# EAGLE design FlexiBoard (EAGLE 7.5.0)
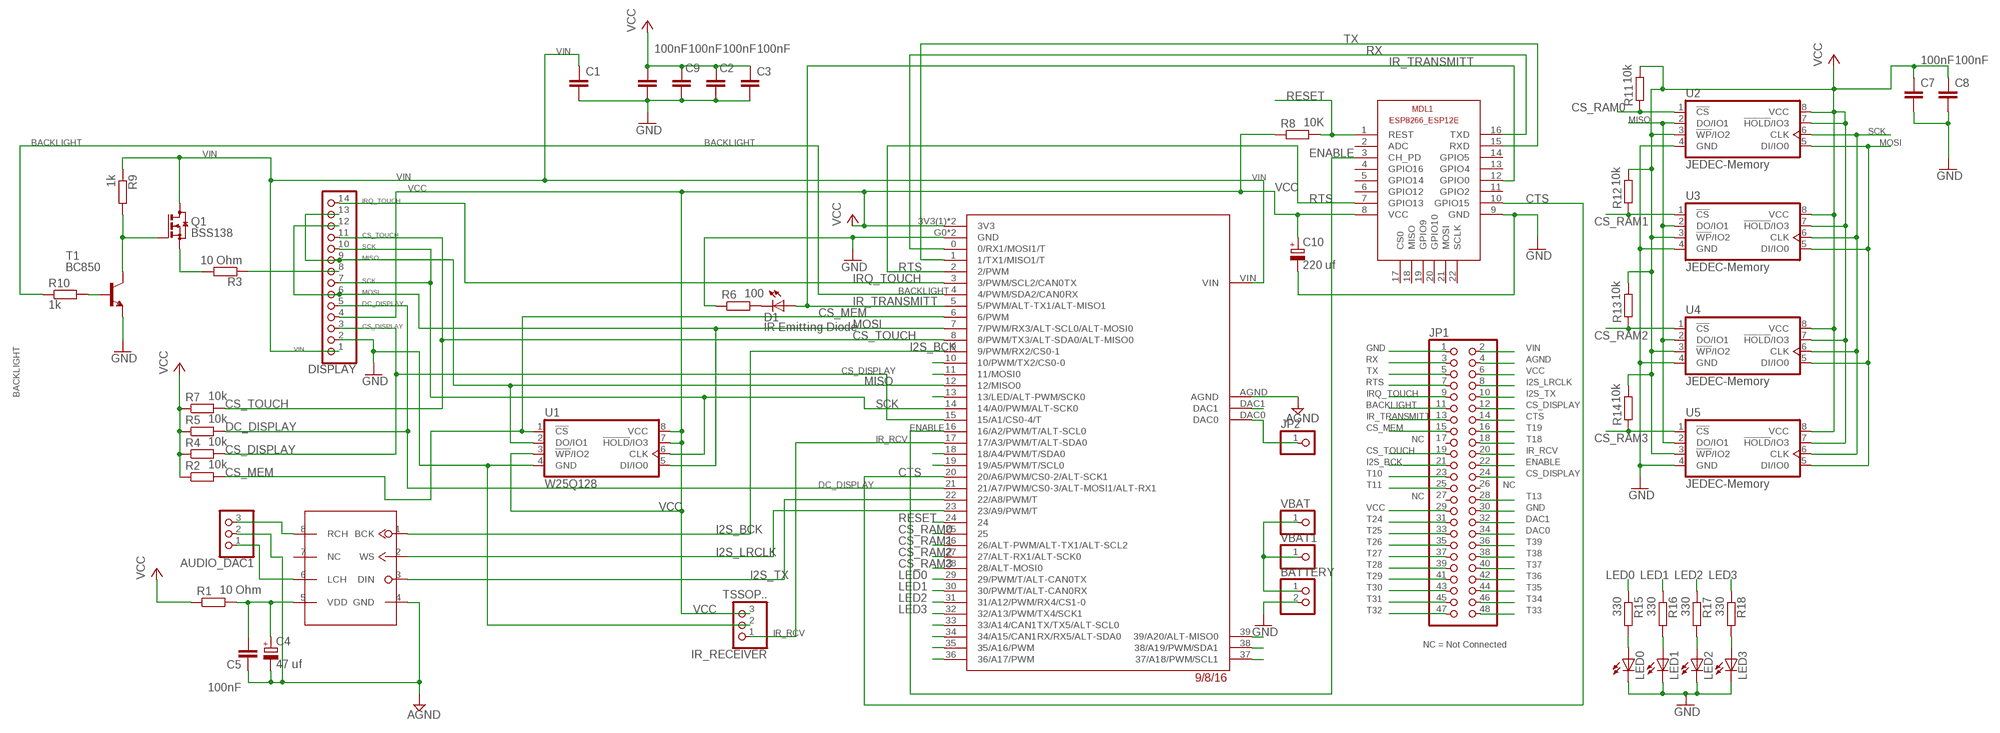
[diagram p0: schematic, sheet 1]

## Parts
AUDIO_DAC1  PINHD-1X3/90  [1X03/90]
BATTERY  PINHD-1X2  [1X02]
C1  100nF  C-EUC0603  [C0603]
C2  100nF  C-EUC0603  [C0603]
C3  100nF  C-EUC0603  [C0603]
C4  47 uf  CPOL-EUE1.8-4  [E1,8-4]
C5  100nF  C-EUC0603  [C0603]
C6  100nF  C-EUC0603  [C0603]
C7  100nF  C-EUC0603  [C0603]
C8  100nF  C-EUC0603  [C0603]
C9  100nF  C-EUC0603  [C0603]
C10  220 uf  CPOL-EUE1.8-4  [E1,8-4]
D1  IR Emitting Diode  SFH482  [SFH482]
DISPLAY  PINHD-1X14  [1X14]
IR_RECEIVER  TSSOP..  PINHD-1X3  [1X03]
JP1  PINHD-2X24  [2X24]
JP2  PINHD-1X1  [1X01]
LED0  LEDSML1206  [SML1206]
LED1  LEDSML1206  [SML1206]
LED2  LEDSML1206  [SML1206]
LED3  LEDSML1206  [SML1206]
MDL1  ESP8266-12EESP8266-ESP12E  [ESP8266-ESP12E]
PT8211  PT8211SO8  [SO8]
Q1  BSS138  BSS123  [SOT23]
R1  10 Ohm  R-EU_R0603  [R0603]
R2  10k  R-EU_R0603  [R0603]
R3  10 Ohm  R-EU_R0603  [R0603]
R4  10k  R-EU_R0603  [R0603]
R5  10k  R-EU_R0603  [R0603]
R6  100  R-EU_R0603  [R0603]
R7  10k  R-EU_R0603  [R0603]
R8  10K  R-EU_R0603  [R0603]
R9  1k  R-EU_R0603  [R0603]
R10  1k  R-EU_R0603  [R0603]
R11  10k  R-EU_R0603  [R0603]
R12  10k  R-EU_R0603  [R0603]
R13  10k  R-EU_R0603  [R0603]
R14  10k  R-EU_R0603  [R0603]
R15  330  R-EU_R0603  [R0603]
R16  330  R-EU_R0603  [R0603]
R17  330  R-EU_R0603  [R0603]
R18  330  R-EU_R0603  [R0603]
T1  BC850  [SOT23]
U1  W25Q128  W25Q40BVSS  [SO08-SS]
U2  JEDEC-Memory  W25Q40BVSS  [SO08-SS]
U3  JEDEC-Memory  W25Q40BVSS  [SO08-SS]
U4  JEDEC-Memory  W25Q40BVSS  [SO08-SS]
U5  JEDEC-Memory  W25Q40BVSS  [SO08-SS]
U$2  TEENSY36_OUTERPINS  [T36_OUTER_PINS]
VBAT  PINHD-1X1  [1X01]
VBAT1  PINHD-1X1  [1X01]

## Nets
AGND [AGND]: AUDIO_DAC1.2 C4.- C5.1 JP1.4 PT8211.4(GND) U$2.AGND
BACKLIGHT: JP1.11 R10.1 U$2.4(4/PWM/SDA2/CAN0RX)
CS_DISPLAY: DISPLAY.3 JP1.12 JP1.24 R4.2 U$2.15(15/A1/CS0-4/T)
CS_MEM [signal]: JP1.15 R2.2 U1.1(!CS!) U$2.6(6/PWM)
CS_RAM0: R11.1 U2.1(!CS!) U$2.25
CS_RAM1: R12.1 U3.1(!CS!) U$2.26(26/ALT-PWM/ALT-TX1/ALT-SCL2)
CS_RAM2: R13.1 U4.1(!CS!) U$2.27(27/ALT-RX1/ALT-SCK0)
CS_RAM3: R14.1 U5.1(!CS!) U$2.28(28/ALT-MOSI0)
CS_TOUCH: DISPLAY.11 JP1.19 R7.2 U$2.8(8/PWM/TX3/ALT-SDA0/ALT-MISO0)
CTS [signal]: JP1.14 MDL1.10(GPIO15) U$2.20(20/A6/PWM/CS0-2/ALT-SCK1)
DAC0 [DAC]: JP1.34 JP2.1 U$2.DAC0
DAC1 [DAC]: JP1.32 U$2.DAC1
DC_DISPLAY: DISPLAY.5 R5.2 U$2.21(21/A7/PWM/CS0-3/ALT-MOSI1/ALT-RX1)
ENABLE [signal]: JP1.22 MDL1.3(CH_PD) U$2.16(16/A2/PWM/T/ALT-SCL0)
GND [supply]: BATTERY.2 C1.2 C2.2 C3.2 C6.2 C7.2 C8.2 C9.2 C10.- DISPLAY.2 IR_RECEIVER.2 JP1.1 JP1.30 LED0.C LED1.C LED2.C LED3.C MDL1.9(GND) R6.1 T1.2(E) U1.4(GND) U2.4(GND) U3.4(GND) U4.4(GND) U5.4(GND) U$2.G0(GND) U$2.G2(GND)
I2S_BCK: JP1.21 PT8211.1(BCK) U$2.9(9/PWM/RX2/CS0-1)
I2S_LRCLK: JP1.8 PT8211.2(WS) U$2.23(23/A9/PWM/T)
I2S_TX: JP1.10 PT8211.3(DIN) U$2.22(22/A8/PWM/T)
IR_RCV [signal]: IR_RECEIVER.1 JP1.20 U$2.17(17/A3/PWM/T/ALT-SDA0)
IR_TRANSMITT: D1.A JP1.13 MDL1.12(GPIO0) U$2.5(5/PWM/ALT-TX1/ALT-MISO1)
IRQ_TOUCH: DISPLAY.14 JP1.9 U$2.3(3/PWM/SCL2/CAN0TX)
LED0: R15.1 U$2.29(29/PWM/T/ALT-CAN0TX)
LED1: R16.1 U$2.30(30/PWM/T/ALT-CAN0RX)
LED2: R17.1 U$2.31(31/A12/PWM/RX4/CS1-0)
LED3: R18.1 U$2.32(32/A13/PWM/TX4/SCK1)
LED-DISPLAY [supply]: DISPLAY.8 R3.1
MISO [signal]: DISPLAY.9 DISPLAY.13 U1.2(DO/IO1) U2.2(DO/IO1) U3.2(DO/IO1) U4.2(DO/IO1) U5.2(DO/IO1) U$2.12(12/MISO0)
MOSI [signal]: DISPLAY.6 DISPLAY.12 U1.5(DI/IO0) U2.5(DI/IO0) U3.5(DI/IO0) U4.5(DI/IO0) U5.5(DI/IO0) U$2.7(7/PWM/RX3/ALT-SCL0/ALT-MOSI0)
N$1: AUDIO_DAC1.1 PT8211.6(LCH)
N$2 [supply]: Q1.2(S) R3.2
N$3: BATTERY.1 VBAT1.1 VBAT.1
N$4: LED0.A R15.2
N$5: Q1.1(G) R9.2 T1.3(C)
N$7: LED1.A R16.2
N$8: AUDIO_DAC1.3 PT8211.8(RCH)
N$9: R10.2 T1.1(B)
N$10: D1.K(C) R6.2
N$11: LED2.A R17.2
N$12: LED3.A R18.2
RESET: MDL1.1(REST) R8.2 U$2.24
RTS: JP1.7 MDL1.7(GPIO13) U$2.2(2/PWM)
RX [signal]: JP1.3 MDL1.16(TXD) U$2.0(0/RX1/MOSI1/T)
SCK [signal]: DISPLAY.7 DISPLAY.10 U1.6(CLK) U2.6(CLK) U3.6(CLK) U4.6(CLK) U5.6(CLK) U$2.14(14/A0/PWM/ALT-SCK0)
T10: JP1.23 U$2.10(10/PWM/TX2/CS0-0)
T11: JP1.25 U$2.11(11/MOSI0)
T13: JP1.28 U$2.13(13/LED/ALT-PWM/SCK0)
T18: JP1.18 U$2.18(18/A4/PWM/T/SDA0)
T19: JP1.16 U$2.19(19/A5/PWM/T/SCL0)
T24: JP1.31
T25: JP1.33
T26: JP1.35
T27: JP1.37
T28: JP1.39
T29: JP1.41
T30: JP1.43
T31: JP1.45
T32: JP1.47
T33: JP1.48 U$2.33(33/A14/CAN1TX/TX5/ALT-SCL0)
T34: JP1.46 U$2.34(34/A15/CAN1RX/RX5/ALT-SDA0)
T35: JP1.44 U$2.35(35/A16/PWM)
T36: JP1.42 U$2.36(36/A17/PWM)
T37: JP1.40 U$2.37(37/A18/PWM/SCL1)
T38: JP1.38 U$2.38(38/A19/PWM/SDA1)
T39: JP1.36 U$2.39(39/A20/ALT-MISO0)
TX [signal]: JP1.5 MDL1.15(RXD) U$2.1(1/TX1/MISO1/T)
VCC [supply]: C2.1 C3.1 C6.1 C7.1 C8.1 C9.1 C10.+ DISPLAY.4 IR_RECEIVER.3 JP1.6 JP1.29 MDL1.8(VCC) R1.1 R2.1 R4.1 R5.1 R7.1 R8.1 R11.2 R12.2 R13.2 R14.2 U1.3(!WP!/IO2) U1.7(!HOLD!/IO3) U1.8(VCC) U2.3(!WP!/IO2) U2.7(!HOLD!/IO3) U2.8(VCC) U3.3(!WP!/IO2) U3.7(!HOLD!/IO3) U3.8(VCC) U4.3(!WP!/IO2) U4.7(!HOLD!/IO3) U4.8(VCC) U5.3(!WP!/IO2) U5.7(!HOLD!/IO3) U5.8(VCC) U$2.3V3(1)(3V3) U$2.3V3(3)(3V3)
VDD [supply]: C4.+ C5.2 PT8211.5(VDD) R1.2
VIN [supply]: C1.1 DISPLAY.1 JP1.2 Q1.3(D) R9.1 U$2.VIN
Unconnected: JP1.17 JP1.26 JP1.27 MDL1.2(ADC) MDL1.4(GPIO16) MDL1.5(GPIO14) MDL1.6(GPIO12) MDL1.11(GPIO2) MDL1.13(GPIO4) MDL1.14(GPIO5) MDL1.17(CS0) MDL1.18(MISO) MDL1.19(GPIO9) MDL1.20(GPIO10) MDL1.21(MOSI) MDL1.22(SCLK) PT8211.7(NC)

## Notes on the sheet
- NC
- NC
- NC
- NC = Not Connected

## Library data of the parts
AUDIO_DAC1 IR_RECEIVER = pinhead:PINHD-1X3: PIN HEADER
BATTERY = pinhead:PINHD-1X2: PIN HEADER
C1-C3 C5-C9 = rcl:C-EU: CAPACITOR, European symbol
C4 C10 = resistor:CPOL-EU: POLARIZED CAPACITOR, European symbol
D1 = led:SFH482: IR LED infrared emitting diode, Infineon
DISPLAY = pinhead:PINHD-1X14: PIN HEADER
JP1 = pinhead:PINHD-2X24: PIN HEADER
JP2 VBAT VBAT1 = pinhead:PINHD-1X1: PIN HEADER
LED0 LED1-LED3 = led:LED: LED OSRAM: - CHIPLED LG R971, LG N971, LY N971, LG Q971, LY Q971, LO R971, LY R971 LH N974, LH R974 LS Q976, LO Q976, LY Q976 LO Q996 - Hyper CHIPLED LW Q18S LB Q993, LB Q99A, LB R99A - SideLED LS A670, LO A670, LY A670, LG A670, LP A670 LB A673, LV A673, LT A673, LW A673 LH A674 LY A675 LS A676, LA A676, LO A676, LY A676, LW A676 LS A679, LY A679, LG A679 - Hyper Micro SIDELED® LS Y876, LA Y876, LO Y876, LY Y876 LT Y87S - SmartLED LW L88C, LW L88S LB L89C, LB L89S, LG L890 LS L89K, LO L89K, LY L89K LS L896, LA L896, LO L896, LY L896 - TOPLED LS T670, LO T670, LY T670, LG T670, LP T670 LSG T670, LSP T670, LSY T670, LOP T670, LYG T670 LG T671, LOG T671, LSG T671 LB T673, LV T673, LT T673, LW T673 LH T674 LS T676, LA T676, LO T676, LY T676, LB T676, LH T676, LSB T676, LW T676 LB T67C, LV T67C, LT T67C, LS T67K, LO T67K, LY T67K, LW E67C LS E67B, LA E67B, LO E67B, LY E67B, LB E67C, LV E67C, LT E67C LW T67C LS T679, LY T679, LG T679 LS T770, LO T770, LY T770, LG T770, LP T770 LB T773, LV T773, LT T773, LW T773 LH T774 LS E675, LA E675, LY E675, LS T675 LS T776, LA T776, LO T776, LY T776, LB T776 LHGB T686 LT T68C, LB T68C - Hyper Mini TOPLED® LB M676 - Mini TOPLED Santana® LG M470 LS M47K, LO M47K, LY M47K Source: http://www.osram.convergy.de LUXEON: - LUMILED® LXK2-PW12-R00, LXK2-PW12-S00, LXK2-PW14-U00, LXK2-PW14-V00 LXK2-PM12-R00, LXK2-PM12-S00, LXK2-PM14-U00 LXK2-PE12-Q00, LXK2-PE12-R00, LXK2-PE12-S00, LXK2-PE14-T00, LXK2-PE14-U00 LXK2-PB12-K00, LXK2-PB12-L00, LXK2-PB12-M00, LXK2-PB14-N00, LXK2-PB14-P00, LXK2-PB14-Q00 LXK2-PR12-L00, LXK2-PR12-M00, LXK2-PR14-Q00, LXK2-PR14-R00 LXK2-PD12-Q00, LXK2-PD12-R00, LXK2-PD12-S00 LXK2-PH12-R00, LXK2-PH12-S00 LXK2-PL12-P00, LXK2-PL12-Q00, LXK2-PL12-R00 Source: www.luxeon.com KINGBRIGHT: KA-3528ASYC Source: www.kingbright.com
MDL1 = ESP8266-ESP12E:ESP8266-12E: ESP8266-12E with additional I/O and GPIO04/05 corrected The author cannot warrant that this library is free from error or will meet your specific requirements. Created by PuceBaboon.com. Komagane, Nagano, JAPAN
PT8211 = PT8211:PT8211
Q1 = transistor-small-signal:BSS123: N-CHANNEL MOS FET
R1-R18 = resistor:R-EU_: RESISTOR, European symbol
T1 = transistor-neu-to92:BC850: NPN TRANSISTOR
U1-U5 = winbond:W25Q40BV: EEPROM 4 Mbit SPI Serial Flash with Dual and Quad SPI
U$2 = Teensy_3_6:TEENSY36_OUTERPINS

## Net classes
0 default: width 0.152 mm, clearance 0.205 mm
1 supply: width 0.305 mm, clearance 0.205 mm to class 0, clearance 0.205 mm
2 signal: width 0.152 mm, clearance 0.205 mm to class 0, clearance 0.205 mm to class 1, clearance 0.205 mm
3 AGND: width 0.203 mm
4 DAC: width 0.203 mm

## Board
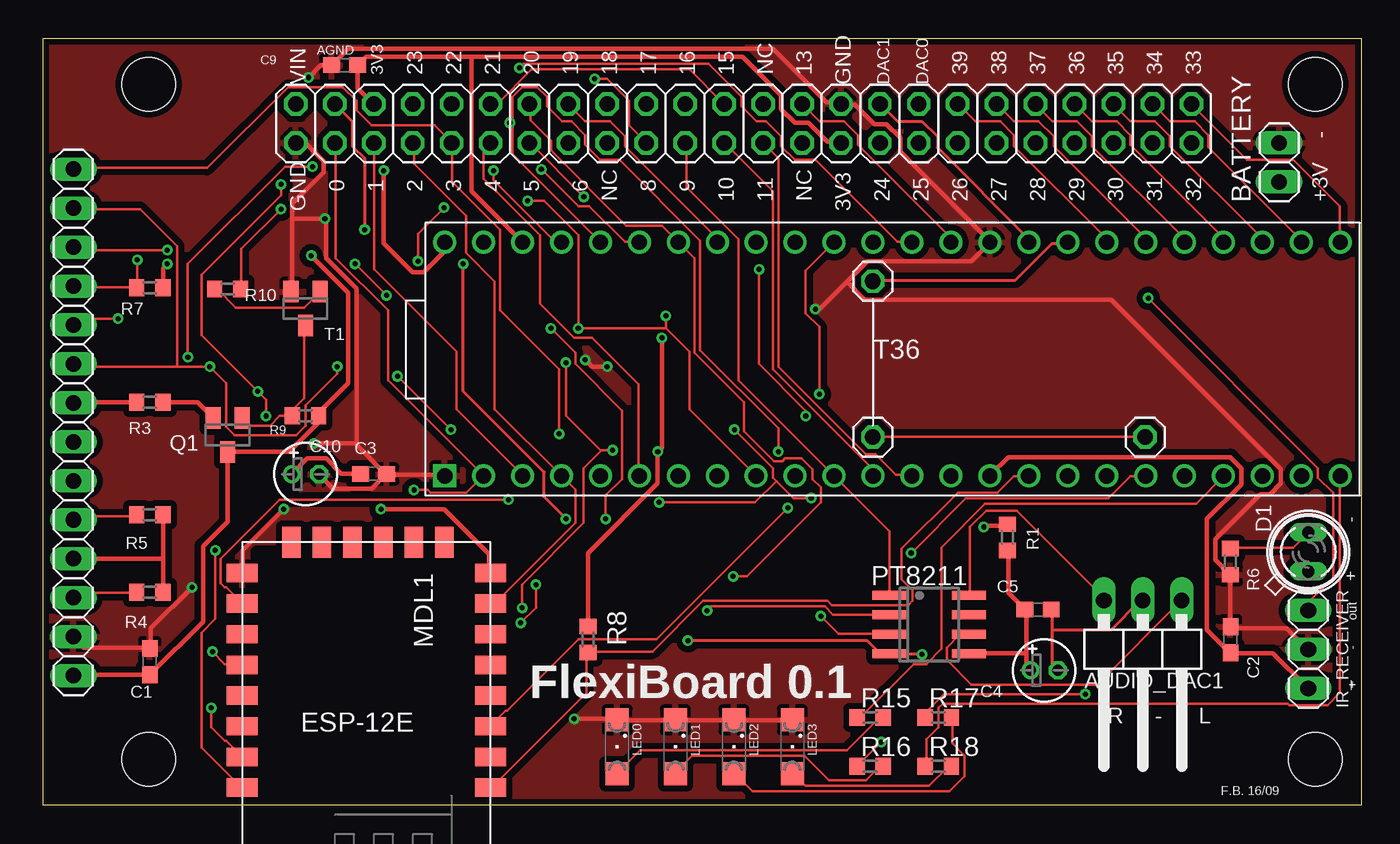
[diagram p1: board, top side]
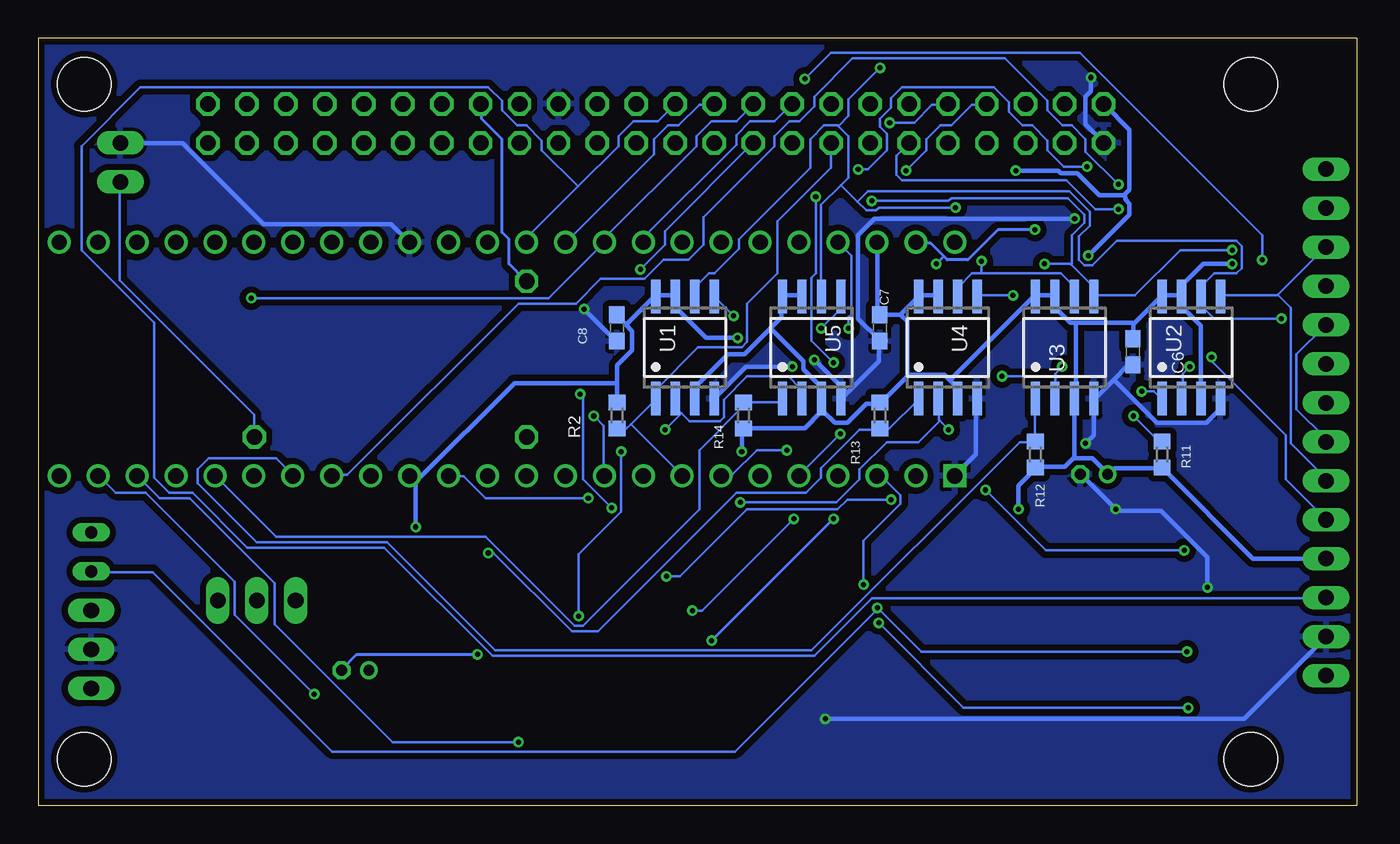
[diagram p2: board, bottom side, seen from below]

Size 86 x 50 mm. Coordinates in mm from the lower left corner, seen from the top.
Outline: 0,50 0,0 86,0 86,50 0,50
Copper layers (1*16): Top 0.0356mm / dielectric 1.5011mm / Bottom 0.0356mm
Design rules "MakerWorks *": minimum track width 6mil, minimum drill 13mil, track to track 6mil, track to pad 10mil, pad to pad 6mil, via to via 6mil, smd to smd 6mil, copper to edge 15mil, drill to drill 6mil, minimum pad ring 7mil, minimum via ring 7mil, stop-mask expansion 3mil, vias tented up to drill 15mil, thermal gap 10mil
Holes 3.5 mm at 6.92,3 6.92,47 83,47 83,3
bKeepout: area 33,0 to 63,19
tRestrict: area 14,0 to 28.6,16.5

### Footprints (pad centres in the part's own frame; a part is rotated, then mirrored left to right if it is on the bottom)
1X03/90 = drill 1.016 long: 1 -2.54,-3.81; 2 0,-3.81; 3 2.54,-3.81
1X02 = drill 1.016 long: 1 -1.27,0; 2 1.27,0
C0603 = smd 1.1 x 1: 1 -0.85,0; 2 0.85,0
E1,8-4 = drill 0.711 pad 1.168: + -0.889,0 | drill 0.711 pad 1.168 octagon: - 0.889,0
SFH482 = drill 0.813 long: A -1.27,0; K 1.27,0
1X14 = drill 1.016 long: 1 -16.51,0; 2 -13.97,0; 3 -11.43,0; 4 -8.89,0; 5 -6.35,0; 6 -3.81,0; 7 -1.27,0; 8 1.27,0; 9 3.81,0; 10 6.35,0; 11 8.89,0; 12 11.43,0; 13 13.97,0; 14 16.51,0
1X03 = drill 1.016 long: 1 -2.54,0; 2 0,0; 3 2.54,0
2X24 = drill 1.016 octagon: 1 -27.94,-1.27; 2 -27.94,1.27; 3 -25.4,-1.27; 4 -25.4,1.27; 5 -22.86,-1.27; 6 -22.86,1.27; 7 -20.32,-1.27; 8 -20.32,1.27; 9 -17.78,-1.27; 10 -17.78,1.27; 11 -15.24,-1.27; 12 -15.24,1.27; 13 -12.7,-1.27; 14 -12.7,1.27; 15 -10.16,-1.27; 16 -10.16,1.27; 17 -7.62,-1.27; 18 -7.62,1.27; 19 -5.08,-1.27; 20 -5.08,1.27; 21 -2.54,-1.27; 22 -2.54,1.27; 23 0,-1.27; 24 0,1.27; 25 2.54,-1.27; 26 2.54,1.27; 27 5.08,-1.27; 28 5.08,1.27; 29 7.62,-1.27; 30 7.62,1.27; 31 10.16,-1.27; 32 10.16,1.27; 33 12.7,-1.27; 34 12.7,1.27; 35 15.24,-1.27; 36 15.24,1.27; 37 17.78,-1.27; 38 17.78,1.27; 39 20.32,-1.27; 40 20.32,1.27; 41 22.86,-1.27; 42 22.86,1.27; 43 25.4,-1.27; 44 25.4,1.27; 45 27.94,-1.27; 46 27.94,1.27; 47 30.48,-1.27; 48 30.48,1.27
1X01 = drill 1.016 octagon: 1 0,0
SML1206 = smd 1.5 x 1.5: A 1.75,0; C -1.75,0
ESP8266-ESP12E = smd 2 x 1.2: 1 -7.62,5.84; 2 -7.62,3.84; 3 -7.62,1.84; 4 -7.62,-0.16; 5 -7.62,-2.16; 6 -7.62,-4.16; 7 -7.62,-6.16; 8 -7.62,-8.16; 9 8.58,-8.16; 10 8.58,-6.16; 11 8.58,-4.16; 12 8.58,-2.16; 13 8.58,-0.16; 14 8.58,1.84; 15 8.58,3.84; 16 8.58,5.84 | smd 1.2 x 2: 17 -4.62,-10.16; 18 -2.62,-10.16; 19 -0.62,-10.16; 20 1.38,-10.16; 21 3.38,-10.16; 22 5.38,-10.16
SO8 = smd 0.6 x 2.2: 1 -1.905,-2.6; 2 -0.635,-2.6; 3 0.635,-2.6; 4 1.905,-2.6; 5 1.905,2.6; 6 0.635,2.6; 7 -0.635,2.6; 8 -1.905,2.6
SOT23 = smd 1 x 1.4: 1 -0.95,-1.1; 2 0.95,-1.1; 3 0,1.1
R0603 = smd 1 x 1.1: 1 -0.85,0; 2 0.85,0
SO08-SS = smd 0.6 x 2.2: 1 -1.905,-3.33; 2 -0.635,-3.33; 3 0.635,-3.33; 4 1.905,-3.33; 5 1.905,3.33; 6 0.635,3.33; 7 -0.635,3.33; 8 -1.905,3.33
T36_OUTER_PINS = drill 1: 0 -15.24,-5.08; 1 -12.7,-5.08; 2 -10.16,-5.08; 3 -7.62,-5.08; 3V3(1) 17.78,-5.08; 3V3(3) -12.7,10.16; 4 -5.08,-5.08; 5 -2.54,-5.08; 6 0,-5.08; 7 2.54,-5.08; 8 5.08,-5.08; 9 7.62,-5.08; 10 10.16,-5.08; 11 12.7,-5.08; 12 15.24,-5.08; 13 15.24,10.16; 14 12.7,10.16; 15 10.16,10.16; 16 7.62,10.16; 17 5.08,10.16; 18 2.54,10.16; 19 0,10.16; 20 -2.54,10.16; 21 -5.08,10.16; 22 -7.62,10.16; 23 -10.16,10.16; 24 20.32,-5.08; 25 22.86,-5.08; 26 25.4,-5.08; 27 27.94,-5.08; 28 30.48,-5.08; 29 33.02,-5.08; 30 35.56,-5.08; 31 38.1,-5.08; 32 40.64,-5.08; 33 40.64,10.16; 34 38.1,10.16; 35 35.56,10.16; 36 33.02,10.16; 37 30.48,10.16; 38 27.94,10.16; 39 25.4,10.16; AGND -15.24,10.16; DAC0 22.86,10.16; DAC1 20.32,10.16; G2 17.78,10.16; VIN -17.78,10.16 | drill 1 square: G0 -17.78,-5.08

### Placement (x,y rotation side)
AUDIO_DAC1  71.75,9.53 180 top
BATTERY  80.64,41.91 90 top
C1  6.99,9.37 90 top
C2  77.47,10.79 90 top
C3  21.59,21.59 0 top
C4  65.33,8.79 0 top
C5  64.92,12.75 180 top
C6  14.61,29.55 270 bottom
C7  31.11,31.11 270 bottom
C8  48.26,31.11 270 bottom
C9  19.68,48.26 180 top
C10  17.14,21.59 0 top
D1  82.55,16.51 90 top
DISPLAY  2,24.96 90 top
IR_RECEIVER  82.55,10.16 270 top
JP1  44.45,44.45 0 top
JP2  54.15,34.16 0 top
LED0  37.47,3.81 270 top
LED1  41.27,3.81 270 top
LED2  45.09,3.81 270 top
LED3  48.9,3.81 270 top
MDL1  21.59,6.99 180 top
PT8211  57.82,11.78 270 top
Q1  12.06,24.13 180 top
R1  62.91,17.46 270 top
R2  48.26,25.4 270 bottom
R3  6.99,26.27 0 top
R4  6.99,13.89 180 top
R5  6.99,18.94 180 top
R6  77.47,15.88 90 top
R7  6.99,33.73 180 top
R8  35.56,10.79 270 top
R9  17.14,25.4 180 top
R10  12.06,33.66 180 top
R11  12.7,22.86 270 bottom
R12  20.95,22.86 270 bottom
R13  31.11,25.4 90 bottom
R14  40.01,25.4 270 bottom
R15  53.98,5.71 0 top
R16  53.98,2.54 0 top
R17  58.42,5.71 0 top
R18  58.42,2.54 0 top
T1  17.14,32.38 180 top
U1  43.81,29.84 0 bottom
U2  10.79,29.84 0 bottom
U3  19.05,29.84 0 bottom
U4  26.67,29.84 0 bottom
U5  35.56,29.84 0 bottom
U$2  44,26.54 0 top
VBAT  71.91,24 0 top
VBAT1  54.15,24 0 top

### Tracks (layer width: path | path; a pad name or v marks a point on that pad's centre or on a via)
AGND  (via drill 0.33)
  Top 0.203: v21,37.53 21,42.17 20.19,42.98 20.19,44.59 19.12,45.66 JP1.4 | 65.85,11.44 65.85,9.2 66.21,8.85 C4.- | 65.85,11.44 65.85,12.69 C5.1 | v57.36,9.83 55.31,9.83 PT8211.4 55.13,9.83 54.68,9.83 53.79,10.72 v42.08,10.72 | 65.85,11.44 69.69,11.44 71.57,13.31 71.75,13.31 AUDIO_DAC1.2 | v27.43,35.29 27.43,26.98 32.7,21.71 32.7,20.1 v34.13,18.67
  Bottom 0.203: 26.94,35.78 26.72,35.56 25.38,35.56 23.41,37.53 v21,37.53 | 26.94,35.78 27.79,36.63 28.68,36.63 U$2.AGND | v57.36,9.83 65.22,9.83 66.21,8.85 C4.- | v27.43,35.29 26.94,35.78 | v42.08,10.72 v34.13,18.67
BACKLIGHT  (via drill 0.33)
  Top 0.152: v15.55,38.87 12.96,36.28 12.96,33.69 R10.1 | U$2.4 38.87,21.53 38.87,27.43 35.83,30.47 34.67,30.47 32.43,32.7 32.43,37.17 28.77,40.83 28.77,42.8 29.13,43.16 JP1.11
  Bottom 0.152: v15.55,38.87 17.07,38.87 18.94,40.74 29.66,40.74 30.02,41.1 30.02,42.35 29.22,43.16 JP1.11
CS_DISPLAY
  Top 0.152: R4.2 6.08,13.85 2.32,13.85 2.06,13.58 DISPLAY.3 | JP1.12 29.22,45.75 29.66,45.75 31.9,47.98 42.17,47.98 44.41,45.75 JP1.24
  Bottom 0.152: 50.8,40.34 48.16,42.98 48.16,43.6 47.18,44.59 45.57,44.59 44.5,45.66 JP1.24 | 50.8,40.34 54.15,36.99 54.15,36.72 U$2.15 | 50.8,40.34 53.16,42.71 53.16,43.34 54.15,44.32 54.77,44.32 55.75,45.3 55.75,45.93 56.65,46.82 79.34,46.82 83.19,42.98 83.19,36.19 78.45,31.45 78.45,21.36 77.47,20.37 75.95,20.37 72.37,16.8 63.44,16.8 56.38,9.74 35.38,9.74 31.63,13.49 2.06,13.49 DISPLAY.3
CS_MEM
  Bottom 0.152: 47.35,24.84 45.75,26.45 U1.1 45.66,26.54 45.66,27.16 42.98,29.84 40.12,29.84 39.76,30.2 39.76,32.7 37.8,34.67 37.8,38.06 34.31,41.55 34.31,43.16 JP1.15 | 47.35,24.84 47.62,24.57 48.25,24.57 R2.2 | 47.35,24.84 44.05,21.53 U$2.6
CS_RAM0  (via drill 0.33)
  Top 0.152: v14.56,25.38 14.56,26.45 v14.03,26.98 10.37,30.65 10.37,34.58 15.55,39.76 v15.55,40.48
  Bottom 0.152: v14.56,25.38 12.96,23.77 12.78,23.77 R11.1 | v14.03,26.98 13.22,26.98 12.78,26.54 U2.1 | v15.55,40.48 17.69,42.62 17.69,43.42 18.59,44.32 19.21,44.32 20.19,45.3 20.19,45.93 22.96,48.7 32.88,48.7 35.38,46.19 35.38,45.57 36.37,44.59 36.99,44.59 37.97,43.6 37.97,42.98 42.62,38.33 42.62,36.54 43.6,35.56 45.21,35.56 46.46,34.31 49.32,34.31 50.93,32.7 54.68,32.7 65.85,21.53 66.83,21.53 U$2.25
CS_RAM1
  Bottom 0.152: U3.1 21,26.45 21,23.77 R12.1 21,23.68 21.98,23.68 35.56,10.1 56.2,10.1 63.26,17.16 71.75,17.16 75.59,21 75.59,21.89 74.88,22.61 70.5,22.61 69.42,21.53 U$2.26
CS_RAM2  (via drill 0.33)
  Top 0.152: v56.65,16.44 60.22,20.01 69.51,20.01 70.94,21.44 71.93,21.44 U$2.27
  Bottom 0.152: U4.1 28.59,26.45 30.47,24.57 31.09,24.57 R13.1 31.18,24.48 32.43,24.48 34.94,21.98 34.94,21.36 35.92,20.37 40.48,20.37 49.5,11.35 51.2,11.35 56.29,16.44 v56.65,16.44
CS_RAM3
  Bottom 0.152: U5.1 37.53,26.45 37.71,26.27 39.94,26.27 R14.1 40.03,26.18 40.03,26 42.89,23.14 42.89,19.3 50.48,11.71 51.02,11.71 56.83,17.51 70.5,17.51 74.43,21.44 U$2.28
CS_TOUCH  (via drill 0.33)
  Top 0.152: DISPLAY.11 2.06,33.77 6.08,33.77 R7.2 6.17,33.77 v6.17,35.56 | v49.77,25.38 49.77,25.73 46.73,28.77 v46.73,34.94 | v36.01,47.35 36.81,47.35 38.24,45.93 38.24,44.32 39.31,43.24 JP1.19
  Bottom 0.152: v49.77,25.38 49.14,24.75 49.14,21.53 U$2.8 | v46.73,34.94 45.12,36.54 45.12,37.44 39.4,43.16 JP1.19 | v6.17,35.56 6.17,37.17 18.05,49.05 34.31,49.05 v36.01,47.35
CTS  (via drill 0.33)
  Top 0.152: v30.38,19.93 15.46,19.93 11.62,16.08 11.62,14.47 11.88,14.21 11.97,14.21 12.96,13.22 MDL1.10 | v45.03,14.92 45.93,14.92 50.75,19.75 50.75,20.73 50.22,21.27 50.22,21.89 49.5,22.61 48.43,22.61 48.25,22.43 47.71,22.43 45.75,24.39 45.75,26.27 42.53,29.48 42.53,35.65 41.55,36.63 U$2.20 41.46,36.72 40.39,37.8 38.06,37.8 33.15,42.71 33.15,43.34 31.81,44.67 31.81,45.66 JP1.14
  Bottom 0.152: v30.38,19.93 33.24,19.93 33.86,19.3 39.76,19.3 44.14,14.92 v45.03,14.92
DAC0
  Top 0.203: U$2.DAC0 66.83,36.63 65.85,36.63 63.44,34.22 54.23,34.22 JP2.1
  Bottom 0.203: JP1.34 57.09,45.66 57.09,44.76 55.75,43.42 55.75,37.35 55.31,36.9 55.31,35.29 54.23,34.22 JP2.1
DAC1
  Top 0.203: U$2.DAC1 64.24,36.72 64.24,36.99 58.35,42.89 58.35,43.6 57.36,44.59 55.75,44.59 54.68,45.66 JP1.32
DC_DISPLAY  (via drill 0.33)
  Top 0.152: R5.2 6.08,18.85 2.23,18.85 2.06,18.67 DISPLAY.5 | v32.52,41.46 34.94,39.05 35.65,39.05 37.97,36.72 38.87,36.72 U$2.21 | v17.6,41.64 15.81,41.64 9.47,35.29 v9.47,29.22
  Bottom 0.152: v32.52,41.46 31.9,41.46 30.65,42.71 30.65,43.78 31.09,44.23 31.09,44.76 30.38,45.48 30.38,46.1 29.66,46.82 23.68,46.82 22.7,45.84 22.7,45.21 21.8,44.32 21.18,44.32 20.19,43.34 20.19,42.71 19.12,41.64 v17.6,41.64 | v9.47,29.22 9.47,28.95 4.65,24.12 4.65,21.27 2.06,18.67 DISPLAY.5
ENABLE  (via drill 0.33)
  Top 0.152: v48.61,19.39 40.03,10.81 34.94,10.81 30.29,6.17 30.2,6.17 29.22,5.18 MDL1.3 | v50.66,26.8 50.66,31.18 49.77,32.08 49.77,34.85 51.55,36.63 U$2.16
  Bottom 0.152: v48.61,19.39 50.48,21.27 50.48,26.63 v50.66,26.8 | JP1.22 41.99,45.66 42.89,45.66 44.23,44.32 44.94,44.32 45.84,43.42 45.84,42.44 51.55,36.72 U$2.16
GND  (via drill 0.33)
  Top 0.305: IR_RECEIVER.2 82.47,10.19 81.13,11.53 77.56,11.53 C2.2 77.47,11.71 77.47,15.01 R6.1 77.38,15.1 76.48,15.99 76.48,17.33 79.43,20.28 80.06,20.28 80.77,21 80.77,21.89 69.69,32.97 53.61,32.97 52.45,34.13 | v50.39,32.34 50.66,32.34 52.45,34.13 | 52.45,34.13 53.79,35.47 60.58,35.47 61.74,36.63 U$2.G2 61.74,36.81 55.93,42.62 55.93,43.51 55.04,44.41 54.23,44.41 52.98,45.66 52.09,45.66 JP1.30 52,45.84 51.11,45.84 47.62,49.32 19.93,49.32 18.94,48.34 C9.2 18.76,48.25 18.14,48.25 v17.33,47.45 | v36.81,28.59 35.83,28.59 v35.38,29.04 | 16.26,38.24 16.26,39.23 18.32,41.28 18.32,41.99 17.16,43.16 16.53,43.16 JP1.1 | 16.26,38.24 16.26,33.51 T1.2 | 16.26,38.24 v18.41,38.24 18.5,38.15 18.5,35.65 20.46,33.69 20.46,23.68 20.37,23.59 | LED3.C 48.87,5.54 45.21,5.54 LED2.C 45.03,5.54 41.37,5.54 LED1.C 41.19,5.54 37.53,5.54 LED0.C 37.35,5.63 v34.67,5.63 | C3.2 22.52,21.53 26.18,21.53 U$2.G0 | DISPLAY.2 2.06,10.9 2.68,10.28 6.97,10.28 C1.2 7.06,10.37 7.06,11.53 v9.74,14.21 | v15.73,19.3 13.04,16.62 13.04,15.19 MDL1.9 | C3.2 22.34,21.53 21.44,20.64 18.94,20.64 18.05,21.53 C10.- | 20.37,23.59 v17.69,23.59 | 20.37,23.59 22.34,21.62 C3.2
  Bottom 0.305: v50.39,32.34 48.34,30.29 C8.2 | BATTERY.2 80.59,43.16 76.57,43.16 71.3,37.88 62.99,37.88 61.83,36.72 U$2.G2 | 33.24,26.89 33.6,26.54 U5.4 | 33.24,26.89 31.18,28.95 31.18,30.2 C7.2 31.18,30.38 32.52,31.72 32.52,37.17 31.45,38.24 v18.41,38.24 | v36.81,28.59 39.85,28.59 41.91,26.54 U1.4 | 33.24,26.89 v35.38,29.04 | v17.33,47.45 17.33,46.55 17.69,46.19 17.69,44.41 16.53,43.24 JP1.1 | 15.86,27.74 17.07,26.54 U3.4 17.16,26.36 17.16,24.12 v17.69,23.59 | 15.86,27.74 14.92,28.68 14.65,28.68 C6.2 | 15.86,27.74 13.04,24.93 9.83,24.93 8.94,25.82 8.94,26.45 U2.4 | U4.4 24.84,26.45 24.84,22.87 26.18,21.53 U$2.G0 | C10.- 17.96,21.53 v15.73,19.3 15.64,19.21 12.78,19.21 9.74,16.17 v9.74,14.21 | v34.67,5.63 7.33,5.63 2.06,10.9 DISPLAY.2
  pour Bottom (isolate 0.406): -2.54,52.07 88.27,52.07 88.27,-1.91 -1.91,-1.91
  pour Top (isolate 0.406): -4.45,53.98 90.17,53.98 90.17,53.34 90.17,-7.62 -3.17,-7.62 -3.17,-6.99
I2S_BCK
  Top 0.152: PT8211.1 55.22,13.76 55.22,17.87 51.64,21.44 U$2.9 51.55,21.53 45.39,27.7 45.39,36.9 41.99,40.3 41.99,43.16 JP1.21
I2S_LRCLK  (via drill 0.33)
  Top 0.152: v43.34,12.69 43.6,12.96 51.02,12.96 51.55,12.42 PT8211.2 | v36.72,18.67 36.72,20.19 37.8,21.27 37.8,25.73 34.76,28.77 34.76,29.48 v33.15,31.09 | v29.4,41.37 29.4,40.74 33.42,36.72 33.77,36.72 U$2.23
  Bottom 0.152: v43.34,12.69 42.71,12.69 v36.72,18.67 | v33.15,31.09 33.15,31.81 32.97,31.99 32.97,35.83 33.77,36.63 U$2.23 | v29.4,41.37 28.06,42.71 28.06,43.42 27.16,44.32 26.45,44.32 25.11,45.66 24.21,45.66 JP1.8
I2S_TX  (via drill 0.33)
  Top 0.152: v50.75,12.33 51.91,11.17 55.22,11.17 PT8211.3 | v47.98,23.05 47.98,24.57 42.89,29.66 42.89,36.81 37.62,42.08 36.37,42.08 35.38,43.07 35.38,43.69 34.49,44.59 33.86,44.59 32.88,45.57 32.88,46.19 32.26,46.82 31.27,46.82 30.65,46.19 30.65,44.5 | 30.65,44.5 30.65,42.44 36.37,36.72 U$2.22 | 30.65,44.5 v30.47,44.5
  Bottom 0.152: v50.75,12.33 50.75,16.35 47.98,19.12 v47.98,23.05 | v30.47,44.5 28.86,44.5 27.7,45.66 26.72,45.66 JP1.10
IR_RCV  (via drill 0.33)
  Top 0.152: v72.11,33.06 83.19,21.98 83.19,21.36 84.17,20.37 84.17,14.83 82.56,13.22 82.56,12.78 IR_RECEIVER.1
  Bottom 0.152: JP1.20 39.4,45.66 40.48,44.59 42.08,44.59 43.07,43.6 43.07,42.98 49.05,36.99 49.05,36.72 U$2.17 49.14,36.63 52.72,33.06 v72.11,33.06
IR_TRANSMITT  (via drill 0.33)
  Top 0.152: v11.08,10.01 11.88,9.2 12.96,9.2 MDL1.12 | v31.27,12.87 31.27,14.38 35.29,18.41 35.29,21.98 36.41,23.1 | 36.41,23.1 36.45,23.14 v37.17,23.14 | v35.29,39.67 31.81,43.16 JP1.13 | v34.13,28.86 34.13,25.38 36.41,23.1
  Bottom 0.152: v11.08,10.01 28.41,10.01 v31.27,12.87 31.27,12.78 40.56,3.48 66.83,3.48 78.54,15.19 82.47,15.19 D1.A | v37.17,23.14 39.13,23.14 40.74,21.53 41.46,21.53 U$2.5 | v35.29,39.67 35.29,34.67 35.56,34.4 35.56,30.29 v34.13,28.86
IRQ_TOUCH  (via drill 0.33)
  Top 0.152: v33.69,24.21 33.69,28.41 29.84,32.26 29.84,37.53 26.72,40.65 26.72,43.16 JP1.9 26.63,43.24 25.55,44.32 21.44,44.32 20.46,45.3 20.46,45.93 19.57,46.82 15.99,46.82 10.72,41.55 2.06,41.55 DISPLAY.14
  Bottom 0.152: v33.69,24.21 36.37,21.53 U$2.3
LED0
  Top 0.152: R15.1 53.16,5.72 53.34,5.72 56.83,9.2 57.63,9.2 58.61,10.19 58.61,16.8 61.47,19.66 75.23,19.66 77.02,21.44 U$2.29
LED1  (via drill 0.33)
  Top 0.152: v54.68,4.11 53.16,2.59 R16.1
  Bottom 0.152: v54.68,4.11 62.9,4.11 70.59,11.79 70.59,14.47 76.13,20.01 78.09,20.01 79.52,21.44 U$2.30
LED2  (via drill 0.33)
  Top 0.152: v68,7.24 58.79,7.24 57.63,6.08 57.63,5.72 R17.1
  Bottom 0.152: v68,7.24 73.18,12.42 73.18,14.56 78.98,20.37 80.95,20.37 82.02,21.44 U$2.31
LED3
  Top 0.152: R18.1 57.63,2.59 57.63,4.29 58.44,5.09 58.44,6.34 58.7,6.61 81.22,6.61 81.31,6.52 83.81,6.52 84.61,7.33 84.61,21.44 U$2.32
LED-DISPLAY
  Top 0.305: R3.1 6.08,26.27 2.06,26.27 DISPLAY.8
MISO  (via drill 0.33)
  Top 0.152: v50.12,20.01 48.96,20.01 47.85,21.13 | 47.85,21.13 47.62,21.36 47.62,21.98 v45.12,24.48 | 8.76,28.59 2.14,28.59 2.06,28.68 DISPLAY.9 | 8.76,28.59 v10.9,28.59 11.97,27.52 11.97,24.66 12.51,24.12 16.53,24.12 17.16,24.75 17.16,26.09 19.21,28.14 v19.21,28.59 | v23.14,27.97 v26.63,24.48 | 8.76,28.59 8.76,36.45 6.34,38.87 2.06,38.87 DISPLAY.13 | 47.85,21.13 46.46,19.75 v40.21,19.75
  Bottom 0.152: 44.05,25.55 44.41,25.91 44.41,26.45 U1.2 | 44.05,25.55 43.51,25.02 41.55,25.02 41.28,25.29 41.28,26.45 39.76,27.97 37.08,27.97 36.28,27.16 36.28,26.54 U5.2 | v50.12,20.01 56.83,20.01 58.26,21.44 59.24,21.44 U$2.12 | 44.05,25.55 v45.12,24.48 | v10.9,28.59 11.35,28.14 11.35,26.54 U2.2 | 19.66,27.97 19.66,28.14 v19.21,28.59 | 19.66,27.97 19.66,26.54 U3.2 | v26.63,24.48 27.21,25.06 | 27.21,25.06 27.25,25.11 27.25,26.45 U4.2 | 19.66,27.97 v23.14,27.97 | v40.21,19.75 33.95,19.75 32.43,21.27 32.43,21.89 30.65,23.68 28.59,23.68 27.21,25.06
MOSI  (via drill 0.33)
  Top 0.152: 40.65,31.09 v34.94,31.09 34.94,37.17 32.7,39.4 v31.63,39.4 | 40.65,31.09 42.17,29.57 42.17,25.82 46.46,21.53 U$2.7 | 40.65,31.09 v40.65,31.9 | v8.13,36.19 2.23,36.19 2.06,36.37 DISPLAY.12 | v20.37,35.29 v22.43,33.24
  Bottom 0.152: v34.94,31.09 33.69,32.34 33.69,33.15 U5.5 | v40.65,31.9 41.91,33.15 U1.5 | 5.14,33.28 2.06,36.37 DISPLAY.12 | 5.14,33.28 5.18,33.24 8.85,33.24 U2.5 | v8.13,36.19 11.53,36.19 14.47,33.24 17.07,33.24 U3.5 17.16,33.24 17.16,33.77 18.63,35.25 | v22.43,33.24 24.75,33.24 U4.5 | v20.37,35.29 18.67,35.29 18.63,35.25 | 5.14,33.28 4.29,32.43 4.29,23.59 2.06,21.36 2.06,21.18 DISPLAY.6 | v31.63,39.4 26.63,39.4 26.45,39.58 18.85,39.58 17.78,38.51 17.78,37.97 18.59,37.17 18.59,35.29 18.63,35.25
N$1
  Top 0.152: PT8211.6 60.4,11.08 59.77,11.08 58.97,10.28 58.97,9.47 60.58,7.86 68.8,7.86 74.25,13.31 AUDIO_DAC1.1
N$2
  Top 0.305: R3.2 7.86,26.27 10.1,26.27 11.08,25.29 Q1.2
N$3
  Top 0.152: VBAT1.1 54.23,24.04 71.84,24.04 VBAT.1
  Bottom 0.152: BATTERY.1 80.68,40.56 80.68,34.22 71.93,25.46 71.93,24.04 VBAT.1
N$4
  Top 0.152: R15.2 54.77,5.63 54.5,5.63 52.45,3.57 38.96,3.57 37.53,2.14 LED0.A
N$5
  Top 0.152: Q1.1 13.04,25.2 13.49,24.75 14.83,24.75 15.46,25.38 16.26,25.38 R9.2 16.35,25.46 16.35,25.82 17.07,26.54 17.07,31.27 T1.3
N$7
  Top 0.152: R16.2 54.77,2.5 54.59,2.5 53.7,1.61 51.29,1.61 49.68,3.22 42.35,3.22 41.28,2.14 LED1.A
N$8
  Top 0.152: PT8211.8 60.49,13.76 60.49,18.14 61.56,19.21 63.53,19.21 69.16,13.58 69.16,13.4 AUDIO_DAC1.3
N$9
  Top 0.152: R10.2 11.26,33.6 11.44,33.6 12.6,32.43 17.07,32.43 18.05,33.42 T1.1
N$10
  Top 0.152: R6.2 77.56,16.8 81.58,16.8 82.47,17.69 D1.K
N$11
  Top 0.152: R17.2 59.33,5.63 59.33,4.02 60.13,3.22 60.13,1.88 59.15,0.89 46.28,0.89 45.12,2.06 LED2.A
N$12
  Top 0.152: R18.2 59.24,2.5 59.06,2.5 57.81,1.25 49.77,1.25 48.96,2.06 LED3.A
RESET
  Top 0.152: MDL1.1 29.22,1.07 35.47,7.33 35.47,9.92 R8.2 35.56,10.01 39.76,10.01 43.07,13.31 51.2,13.31 51.47,13.04 56.47,13.04 56.74,13.31 56.74,14.03 56.02,14.74 56.02,16.71 59.69,20.37 62.28,20.37 63.35,21.44 64.24,21.44 U$2.24
RTS
  Top 0.152: MDL1.7 29.22,13.22 29.57,13.22 34.76,18.41 34.76,20.55 33.86,21.44 U$2.2 33.77,21.53 29.48,25.82 29.48,34.13 27.61,36.01 27.61,38.42 24.21,41.82 24.21,43.16 JP1.7
RX  (via drill 0.33)
  Top 0.152: v11.26,16.62 11.26,12.15 10.37,11.26 10.37,3.75 12.96,1.16 MDL1.16 | v24.21,20.55 25.11,20.55 25.29,20.37 27.61,20.37 28.68,21.44 U$2.0 28.68,21.53 22.52,27.7 22.52,32.26 19.12,35.65 19.12,43.16 JP1.3
  Bottom 0.152: v11.26,16.62 20.28,16.62 v24.21,20.55
SCK  (via drill 0.33)
  Top 0.152: v4.91,31.72 2.41,31.72 2.06,31.36 DISPLAY.10 | v31.09,48.07 31.36,48.34 43.42,48.34 45.57,46.19 45.57,45.57 46.55,44.59 47.18,44.59 48.16,43.6 48.16,42.98 49.05,42.08 50.39,42.08 55.75,36.72 56.65,36.72 U$2.14 | v24.48,35.47 24.48,37.26 v26.18,38.96
  Bottom 0.152: v4.91,31.72 9.29,31.72 10.1,32.52 10.1,33.15 U2.6 10.1,33.24 10.1,33.86 9.29,34.67 7.86,34.67 7.5,35.02 7.5,36.45 7.86,36.81 15.64,36.81 17.25,35.2 17.78,35.2 18.14,35.56 18.14,37.08 17.42,37.8 17.42,38.69 18.76,40.03 31.9,40.03 32.57,39.36 | DISPLAY.7 2.06,23.77 2.06,23.95 3.93,25.82 3.93,29.4 2.06,31.27 DISPLAY.10 | 24.48,34.67 25.11,34.67 26,33.77 26,33.24 U4.6 | 24.48,34.67 19.3,34.67 18.5,33.86 18.5,33.24 U3.6 | 33.64,40.43 33.15,40.92 33.15,43.6 33.82,44.27 | 33.64,40.43 34.94,39.13 34.94,33.24 U5.6 | 33.82,44.27 33.86,44.32 34.76,44.32 35.65,43.42 35.65,41.55 40.3,36.9 40.3,36.28 41.91,34.67 42.26,34.67 43.16,33.77 43.16,33.24 U1.6 | v31.09,48.07 33.15,46.02 33.15,44.94 33.82,44.27 | v24.48,35.47 24.48,34.67 | v26.18,38.96 31.18,38.96 31.36,38.78 31.99,38.78 32.57,39.36 | 33.64,40.43 32.57,39.36
T10
  Top 0.152: U$2.10 54.15,21.53 54.15,21.89 47.62,28.41 47.62,40.03 44.5,43.16 JP1.23
T11
  Top 0.152: U$2.11 56.65,21.53 55.66,21.53 54.33,22.87 53.7,22.87 47.98,28.59 47.98,42.17 47,43.16 JP1.25
T13
  Top 0.152: U$2.13 59.24,36.72 59.24,36.99 53.16,43.07 53.16,43.69 52.27,44.59 50.66,44.59 49.59,45.66 JP1.28
T18
  Bottom 0.152: U$2.18 46.46,36.72 46.46,37.08 40.48,43.07 40.48,43.69 39.58,44.59 37.97,44.59 36.9,45.66 JP1.18
T19
  Top 0.152: U$2.19 43.96,36.72 43.96,36.99 37.97,42.98 37.97,43.6 36.99,44.59 35.38,44.59 34.31,45.66 JP1.16
T33
  Top 0.152: U$2.33 84.61,36.72 84.61,39.05 81.58,42.08 78.54,42.08 74.97,45.66 JP1.48
T34
  Top 0.152: U$2.34 82.02,36.72 82.02,36.9 76.04,42.89 76.04,43.69 75.14,44.59 73.53,44.59 72.46,45.66 JP1.46
T35
  Top 0.152: U$2.35 79.52,36.72 79.52,36.99 73.53,42.98 73.53,43.6 72.55,44.59 70.94,44.59 69.87,45.66 JP1.44
T36
  Top 0.152: U$2.36 77.02,36.72 77.02,36.99 70.94,43.07 70.94,43.69 70.05,44.59 68.44,44.59 67.37,45.66 JP1.42
T37
  Top 0.152: U$2.37 74.43,36.72 74.43,36.99 68.44,42.98 68.44,43.6 67.46,44.59 65.85,44.59 64.78,45.66 JP1.40
T38
  Top 0.152: U$2.38 71.93,36.72 71.93,36.99 65.94,42.98 65.94,43.6 64.96,44.59 63.35,44.59 62.28,45.66 JP1.38
T39
  Top 0.152: U$2.39 69.34,36.72 69.34,36.99 63.35,42.98 63.35,43.69 62.46,44.59 60.85,44.59 59.77,45.66 JP1.36
TX  (via drill 0.33)
  Top 0.152: v10.99,6.34 10.99,5.09 11.88,4.2 11.97,4.2 12.96,3.22 MDL1.15 | v31.18,11.88 32.17,12.87 v32.17,14.38 | JP1.5 21.62,43.16 21.62,34.94 26.98,29.57 26.98,25.82 31.27,21.53 U$2.1
  Bottom 0.152: v10.99,6.34 25.64,6.34 v31.18,11.88 | v32.17,14.38 32.17,17.25 29.75,19.66 29.75,20.19 31,21.44 31.27,21.44 U$2.1
VCC  (via drill 0.33)
  Top 0.305: IR_RECEIVER.3 82.47,7.68 80.24,9.92 77.56,9.92 C2.1 77.38,10.01 75.95,11.44 75.95,18.67 78.18,20.91 78.18,21.98 77.47,22.7 62.99,22.7 61.83,21.53 U$2.3V3(1) | v61.38,18.14 61.47,18.23 62.9,18.23 R1.1 | v8.13,35.29 7.86,35.02 7.86,33.77 R7.1 | 7.86,16.08 7.86,18.85 R5.1 | 7.86,16.08 7.86,13.94 R4.1 | 7.86,16.08 2.06,16.08 DISPLAY.4 | C3.1 20.73,21.62 19.48,21.62 18.5,22.61 17.25,22.61 16.26,21.62 C10.+ | v22.07,19.3 26.18,19.3 29.13,16.35 29.13,15.19 MDL1.8 | JP1.6 21.53,45.75 20.55,46.73 C9.1 20.64,48.34 21.09,48.78 27.97,48.78 | 27.97,48.78 45.66,48.78 48.16,46.28 48.16,45.39 49.05,44.5 49.95,44.5 51.2,43.24 52,43.24 JP1.29 | R8.1 35.56,11.71 35.56,16.44 40.12,21 v40.12,23.05 40.39,23.32 v40.39,30.47 | 27.97,48.78 27.97,40.03 31.27,36.72 U$2.3V3(3)
  Bottom 0.305: v61.38,18.14 61.38,21.09 61.74,21.44 U$2.3V3(1) 61.29,21.18 54.95,27.52 48.25,27.52 | 48.25,27.52 48.25,28.68 47.27,29.66 47.27,30.91 47.67,31.32 | 48.25,27.52 48.25,26.27 R2.1 | 47.67,31.32 48.25,31.9 C8.1 | 47.67,31.32 45.84,33.15 U1.8 45.66,33.24 44.5,33.24 U1.7 44.41,33.06 44.41,32.43 42.44,30.47 v40.39,30.47 | 14.56,31.36 14.56,30.47 C6.1 | 14.56,31.36 12.78,33.15 U2.8 12.6,33.24 11.53,33.24 U2.7 | 18.32,31.45 14.65,31.45 14.56,31.36 | 18.32,31.45 18.67,31.45 19.66,32.43 19.66,33.06 U3.7 19.75,33.24 20.91,33.24 U3.8 21.09,33.15 26.54,27.7 | v8.13,35.29 10.01,35.29 11.35,33.95 11.35,33.24 U2.7 | U2.3 10.19,26.54 10.19,31.27 11.35,32.43 11.35,33.06 U2.7 | 18.5,22.61 19.03,22.07 20.91,22.07 R12.2 21,21.89 22.07,20.82 v22.07,19.3 | 18.5,22.61 17.25,22.61 16.35,21.71 C10.+ 16.17,21.62 15.81,21.98 12.78,21.98 R11.2 12.6,21.89 6.79,16.08 2.06,16.08 DISPLAY.4 | 18.5,22.61 18.41,22.7 18.41,26.45 U3.3 18.32,26.63 18.32,31.45 | v40.12,23.05 40.12,24.39 40.03,24.48 R14.2 39.85,24.57 36.01,24.57 34.94,25.64 U5.3 | U5.7 36.28,33.24 37.44,33.24 U5.8 37.53,33.06 37.53,31.81 38.24,31.09 | 38.24,31.09 39.94,29.4 41.01,29.4 43.16,27.25 43.16,26.54 U1.3 | U5.3 34.85,26.45 34.85,25.73 34.04,24.93 33.24,24.93 31.99,26.18 31.18,26.18 R13.2 31,26.27 29.22,28.06 | 26.54,27.7 26.89,28.06 29.22,28.06 | 26.54,27.7 26.09,27.25 26.09,26.54 U4.3 | 29.75,31.99 31.09,31.99 C7.1 31.18,32.08 31.27,32.17 31.27,36.63 U$2.3V3(3) | 29.75,31.99 28.59,33.15 U4.8 28.5,33.24 27.34,33.24 U4.7 | 29.75,31.99 29.31,31.54 29.31,28.14 29.22,28.06 | 38.24,31.09 36.1,28.95 36.1,28.41 35.02,27.34 35.02,26.63 U5.3
VDD
  Top 0.305: 64.15,9.92 64.15,9.11 64.42,8.85 C4.+ | 64.15,9.92 64.15,12.69 C5.2 63.98,12.87 62.99,13.85 62.99,16.53 R1.2 | 64.15,9.92 60.49,9.92 PT8211.5
VIN  (via drill 0.33)
  Top 0.305: v22.25,41.37 22.25,36.63 24.12,34.76 24.84,34.76 26.18,36.1 26.18,36.63 U$2.VIN | DISPLAY.1 2.06,8.49 6.97,8.49 C1.1 7.06,8.58 10.45,11.97 10.45,16.89 12.06,18.5 12.06,22.87 Q1.3 12.15,23.05 16.08,23.05 17.96,24.93 17.96,25.38 R9.1 17.96,25.55 19.93,27.52 19.93,33.42 v17.51,35.83
  Bottom 0.305: v22.25,41.37 19.48,41.37 19.3,41.19 18.23,41.19 16.8,39.76 15.19,39.76 | 15.19,39.76 14.83,40.12 14.83,44.05 16.44,45.66 JP1.2 | v17.51,35.83 14.83,38.51 14.83,39.23 15.1,39.49 15.1,39.67 15.19,39.76

### Text on the board
tPlace: AGND | 3V3 | 23 | 22 | 21 | 20 | 19 | 18 | 17 | 16 | 15 | NC | 13 | 39 | 38 | 37 | 36 | 35 | 34 | 33 | VIN | GND | DAC1 | DAC0 | 0 | 1 | 2 | 3 | 4 | 5 | 6 | 8 | 9 | GND | NC | 10 | 11 | NC | 3V3 | 24 | 25 | 26 | 27 | 28 | 29 | 30 | 31 | 32 | +3V - | - | + | out | - | + | FlexiBoard 0.1 | R | - | L | F.B. 16/09